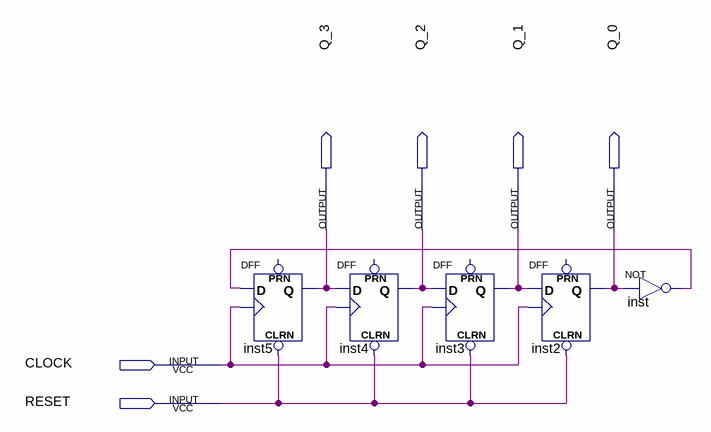
[diagram p0: schematic sheet]
// Quartus schematic johnson_down.bdf as structural Verilog: 5 symbols, 6 pins
module johnson_down (
  input  CLOCK,
  input  RESET,
  output Q_3,
  output Q_2,
  output Q_1,
  output Q_0
);

  wire inst_out;

  DFF inst5 (.CLRN(RESET), .CLK(CLOCK), .D(inst_out), .Q(Q_3));  // open: PRN
  DFF inst4 (.CLRN(RESET), .CLK(CLOCK), .D(Q_3), .Q(Q_2));  // open: PRN
  DFF inst3 (.CLRN(RESET), .CLK(CLOCK), .D(Q_2), .Q(Q_1));  // open: PRN
  DFF inst2 (.CLRN(RESET), .CLK(CLOCK), .D(Q_1), .Q(Q_0));  // open: PRN
  not inst (inst_out, Q_0);
endmodule
